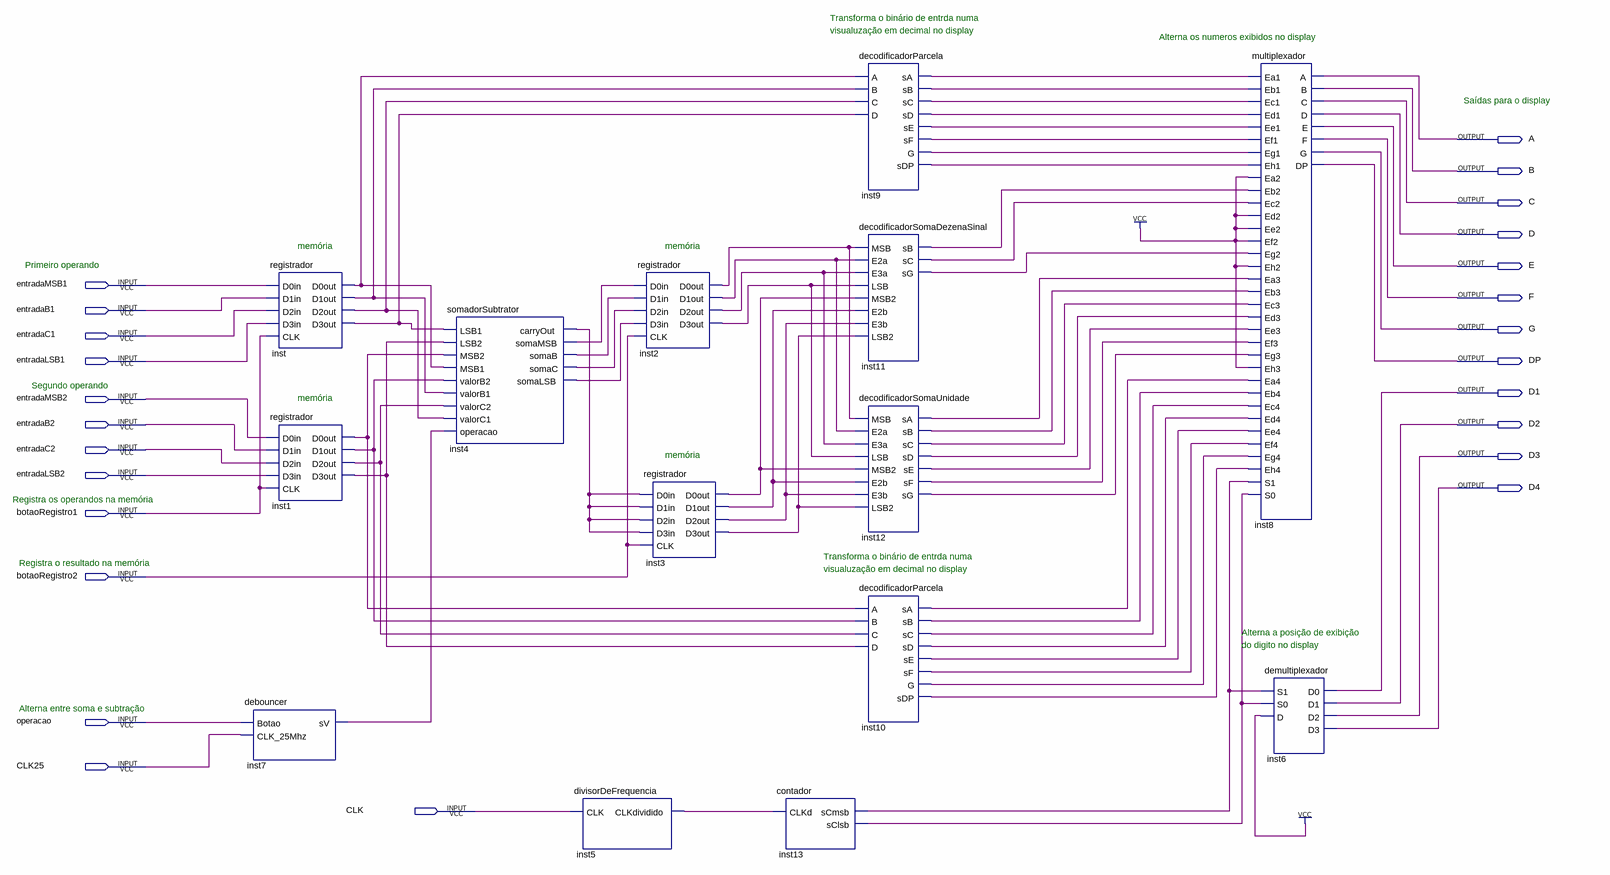
[diagram p0: schematic sheet]
// Quartus schematic calculadoraBinaria.bdf as structural Verilog: 14 symbols, 25 pins
module calculadoraBinaria (
  input  entradaMSB1,
  input  entradaB1,
  input  entradaC1,
  input  entradaLSB1,
  input  entradaMSB2,
  input  entradaB2,
  input  entradaC2,
  input  entradaLSB2,
  input  botaoRegistro1,
  input  botaoRegistro2,
  input  operacao,
  input  CLK25,
  input  CLK,
  output A,
  output B,
  output C,
  output D,
  output E,
  output F,
  output G,
  output DP,
  output D1,
  output D2,
  output D3,
  output D4
);

  wire inst1_d0out, inst1_d1out, inst1_d2out, inst1_d3out, inst2_d0out, inst2_d1out, inst2_d2out,
       inst2_d3out, inst3_d0out, inst3_d1out, inst3_d2out, inst3_d3out, inst4_carryout, inst4_somab,
       inst4_somac, inst4_somalsb, inst4_somamsb, inst5_clkdividido, inst7_sv, inst9_g, inst9_sa, inst9_sb,
       inst9_sc, inst9_sd, inst9_sdp, inst9_se, inst9_sf, inst10_g, inst10_sa, inst10_sb, inst10_sc,
       inst10_sd, inst10_sdp, inst10_se, inst10_sf, inst11_sb, inst11_sc, inst11_sg, inst12_sa, inst12_sb,
       inst12_sc, inst12_sd, inst12_se, inst12_sf, inst12_sg, inst13_sclsb, inst13_scmsb, inst_d0out,
       inst_d1out, inst_d2out, inst_d3out;

  registrador inst (
    .D0in(entradaMSB1), .D1in(entradaB1), .D2in(entradaC1), .D3in(entradaLSB1), .CLK(botaoRegistro1),
    .D0out(inst_d0out), .D1out(inst_d1out), .D2out(inst_d2out), .D3out(inst_d3out));
  registrador inst1 (
    .D0in(entradaMSB2), .D1in(entradaB2), .D2in(entradaC2), .D3in(entradaLSB2), .CLK(botaoRegistro1),
    .D0out(inst1_d0out), .D1out(inst1_d1out), .D2out(inst1_d2out), .D3out(inst1_d3out));
  debouncer inst7 (.Botao(operacao), .CLK_25Mhz(CLK25), .sV(inst7_sv));
  somadorSubtrator inst4 (
    .LSB1(inst_d3out), .LSB2(inst1_d3out), .MSB2(inst1_d0out), .MSB1(inst_d0out), .valorB2(inst1_d1out),
    .valorB1(inst_d1out), .valorC2(inst1_d2out), .valorC1(inst_d2out), .operacao(inst7_sv),
    .carryOut(inst4_carryout), .somaMSB(inst4_somamsb), .somaB(inst4_somab), .somaC(inst4_somac),
    .somaLSB(inst4_somalsb));
  divisorDeFrequencia inst5 (.CLK(CLK), .CLKdividido(inst5_clkdividido));
  registrador inst2 (
    .D0in(inst4_somamsb), .D1in(inst4_somab), .D2in(inst4_somac), .D3in(inst4_somalsb), .CLK(botaoRegistro2),
    .D0out(inst2_d0out), .D1out(inst2_d1out), .D2out(inst2_d2out), .D3out(inst2_d3out));
  registrador inst3 (
    .D0in(inst4_carryout), .D1in(inst4_carryout), .D2in(inst4_carryout), .D3in(inst4_carryout),
    .CLK(botaoRegistro2), .D0out(inst3_d0out), .D1out(inst3_d1out), .D2out(inst3_d2out), .D3out(inst3_d3out));
  contador inst13 (.CLKd(inst5_clkdividido), .sCmsb(inst13_scmsb), .sClsb(inst13_sclsb));
  decodificadorParcela inst9 (
    .A(inst_d0out), .B(inst_d1out), .C(inst_d2out), .D(inst_d3out), .sA(inst9_sa), .sB(inst9_sb),
    .sC(inst9_sc), .sD(inst9_sd), .sE(inst9_se), .sF(inst9_sf), .G(inst9_g), .sDP(inst9_sdp));
  decodificadorSomaDezenaSinal inst11 (
    .MSB(inst2_d0out), .E2a(inst2_d1out), .E3a(inst2_d2out), .LSB(inst2_d3out), .MSB2(inst3_d0out),
    .E2b(inst3_d1out), .E3b(inst3_d2out), .LSB2(inst3_d3out), .sB(inst11_sb), .sC(inst11_sc), .sG(inst11_sg));
  decodificadorSomaUnidade inst12 (
    .MSB(inst2_d0out), .E2a(inst2_d1out), .E3a(inst2_d2out), .LSB(inst2_d3out), .MSB2(inst3_d0out),
    .E2b(inst3_d1out), .E3b(inst3_d2out), .LSB2(inst3_d3out), .sA(inst12_sa), .sB(inst12_sb), .sC(inst12_sc),
    .sD(inst12_sd), .sE(inst12_se), .sF(inst12_sf), .sG(inst12_sg));
  decodificadorParcela inst10 (
    .A(inst1_d0out), .B(inst1_d1out), .C(inst1_d2out), .D(inst1_d3out), .sA(inst10_sa), .sB(inst10_sb),
    .sC(inst10_sc), .sD(inst10_sd), .sE(inst10_se), .sF(inst10_sf), .G(inst10_g), .sDP(inst10_sdp));
  multiplexador inst8 (
    .Ea1(inst9_sa), .Eb1(inst9_sb), .Ec1(inst9_sc), .Ed1(inst9_sd), .Ee1(inst9_se), .Ef1(inst9_sf),
    .Eg1(inst9_g), .Eh1(inst9_sdp), .Ea2(1'b1), .Eb2(inst11_sb), .Ec2(inst11_sc), .Ed2(1'b1), .Ee2(1'b1),
    .Ef2(1'b1), .Eg2(inst11_sg), .Eh2(1'b1), .Ea3(inst12_sa), .Eb3(inst12_sb), .Ec3(inst12_sc),
    .Ed3(inst12_sd), .Ee3(inst12_se), .Ef3(inst12_sf), .Eg3(inst12_sg), .Eh3(1'b1), .Ea4(inst10_sa),
    .Eb4(inst10_sb), .Ec4(inst10_sc), .Ed4(inst10_sd), .Ee4(inst10_se), .Ef4(inst10_sf), .Eg4(inst10_g),
    .Eh4(inst10_sdp), .S1(inst13_scmsb), .S0(inst13_sclsb), .A(A), .B(B), .C(C), .D(D), .E(E), .F(F), .G(G),
    .DP(DP));
  demultiplexador inst6 (.S1(inst13_scmsb), .S0(inst13_sclsb), .D(1'b1), .D0(D1), .D1(D2), .D2(D3), .D3(D4));

  // Notes on the sheet:
  //   Transforma o binário de entrda numa
  //   visualuzação em decimal no display
  //   Alterna os numeros exibidos no display
  //   Saídas para o display
  //   memória
  //   memória
  //   Primeiro operando
  //   Segundo operando
  //   memória
  //   memória
  //   Registra os operandos na memória
  //   Transforma o binário de entrda numa
  //   Registra o resultado na memória
  //   visualuzação em decimal no display
  //   Alterna a posição de exibição
  //   do digito no display
  //   Alterna entre soma e subtração
endmodule
